# Altium project SATA-Modular-Backplane.PrjPcb
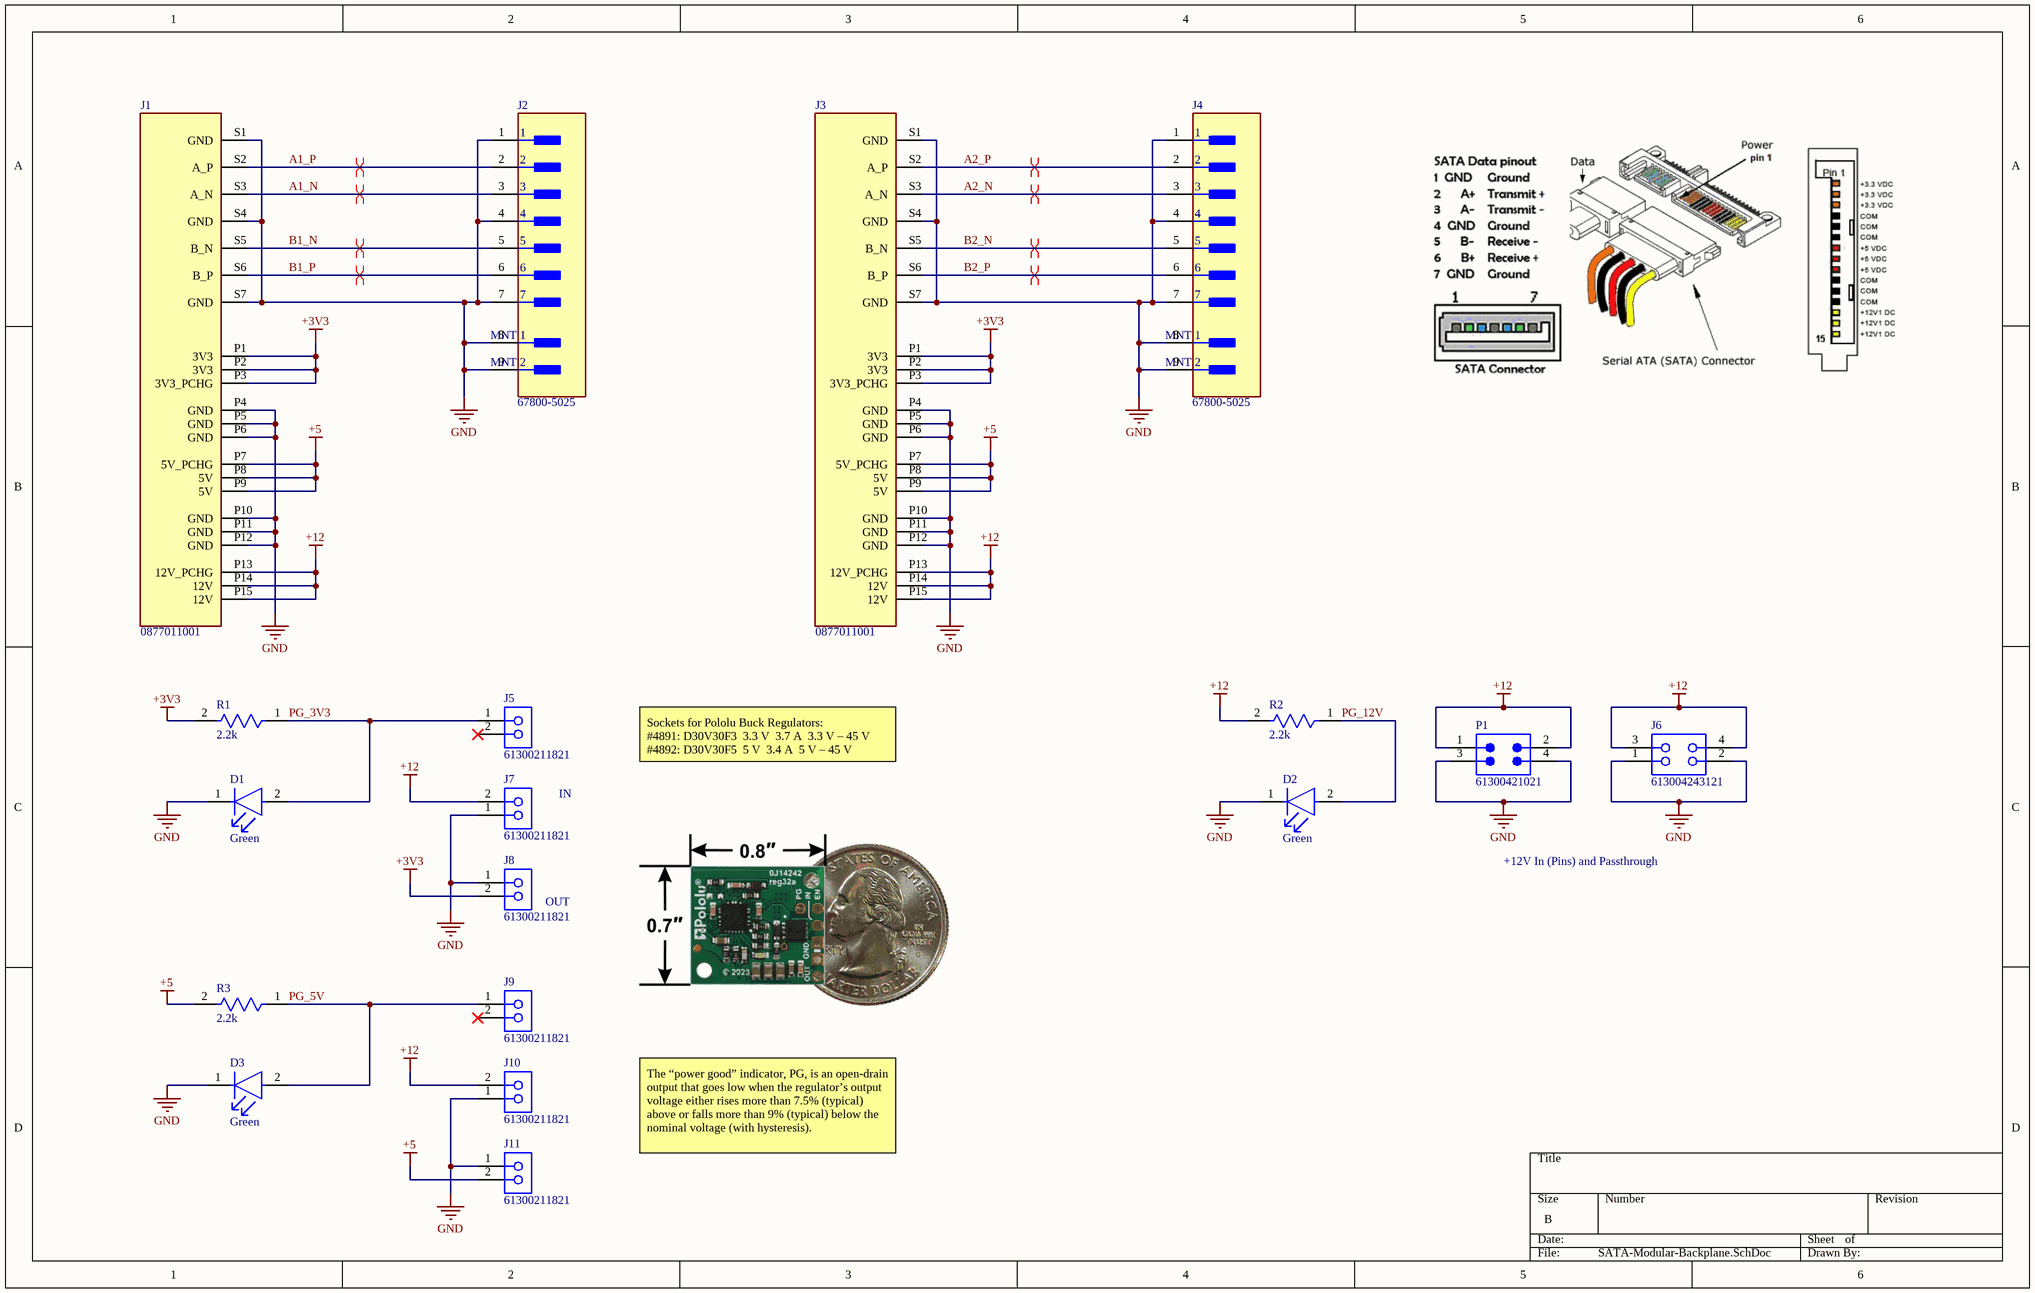
[diagram p0: SATA-Modular-Backplane.SchDoc]
1 sheet, 18 parts. Net scope: global (net labels, ports and power ports of the same name join across sheets).
Board file: SATA-Modular-Backplane.PcbDoc

## Sheet SATA-Modular-Backplane.SchDoc
size B; SheetNumber: 1; SheetTotal: 1

### Parts
D1  Green  [FP-LTST-C170GKT-MFG]
D2  Green  [FP-LTST-C170GKT-MFG]
D3  Green  [FP-LTST-C170GKT-MFG]
J1  0877011001  [0877011001]
J2  67800-5025  [FP-67800-5025-MFG]
J3  0877011001  [0877011001]
J4  67800-5025  [FP-67800-5025-MFG]
J5  61300211821  [61300211821]
J6  613004243121  [613004243121]
J7  61300211821  [61300211821]
J8  61300211821  [61300211821]
J9  61300211821  [61300211821]
J10  61300211821  [61300211821]
J11  61300211821  [61300211821]
P1  61300421021  [61300421021]
R1  2.2k  [FP-CRCW0805-e3-IPC_B]
R2  2.2k  [FP-CRCW0805-e3-IPC_B]
R3  2.2k  [FP-CRCW0805-e3-IPC_B]

### Nets
+3V3: J1.P1(3V3) J1.P2(3V3) J1.P3(3V3_PCHG) J3.P1(3V3) J3.P2(3V3) J3.P3(3V3_PCHG) J8.2 R1.2
+5: J1.P7(5V_PCHG) J1.P8(5V) J1.P9(5V) J3.P7(5V_PCHG) J3.P8(5V) J3.P9(5V) J11.2 R3.2
+12: J1.P13(12V_PCHG) J1.P14(12V) J1.P15(12V) J3.P13(12V_PCHG) J3.P14(12V) J3.P15(12V) J6.3 J6.4 J7.2 J10.2 P1.1 P1.2 R2.2
GND: D1.1(C) D2.1(C) D3.1(C) J1.P4(GND) J1.P5(GND) J1.P6(GND) J1.P10(GND) J1.P11(GND) J1.P12(GND) J1.S1(GND) J1.S4(GND) J1.S7(GND) J2.1 J2.4 J2.7 J2.8(MNT_1) J2.9(MNT_2) J3.P4(GND) J3.P5(GND) J3.P6(GND) J3.P10(GND) J3.P11(GND) J3.P12(GND) J3.S1(GND) J3.S4(GND) J3.S7(GND) J4.1 J4.4 J4.7 J4.8(MNT_1) J4.9(MNT_2) J6.1 J6.2 J7.1 J8.1 J10.1 J11.1 P1.3 P1.4
A1_N: J1.S3(A_N) J2.3
A1_P: J1.S2(A_P) J2.2
A2_N: J3.S3(A_N) J4.3
A2_P: J3.S2(A_P) J4.2
B1_N: J1.S5(B_N) J2.5
B1_P: J1.S6(B_P) J2.6
B2_N: J3.S5(B_N) J4.5
B2_P: J3.S6(B_P) J4.6
PG_3V3: D1.2(A) J5.1 R1.1
PG_5V: D3.2(A) J9.1 R3.1
PG_12V: D2.2(A) R2.1

Not connected (* = marked no-connect by the designer): J5 2*; J9 2*

### Layout directives
differential pair: A1_N, A1_P, A2_N, A2_P, B1_N, B1_P, B2_N, B2_P

### Notes on the sheet
- Sockets for Pololu Buck Regulators:
  #4891: D30V30F3  3.3 V  3.7 A  3.3 V – 45 V
  #4892: D30V30F5  5 V  3.4 A  5 V – 45 V
- IN
- (near J8) OUT
- +12V In (Pins) and Passthrough
- The “power good” indicator, PG, is an open-drain output that goes low when the regulator’s output voltage either rises more than 7.5% (typical) above or falls more than 9% (typical) below the nominal voltage (with hysteresis).

### Library data of the parts
D1-D3 = CMP-1674-00002-6: LED GREEN CLEAR SMD; Dominant Wavelength: 569nm; Lens Style: Diffused; Forward Voltage: 2.1V; Number of Elements: 1; Wavelength: 565nm; Luminous Intensity: 6mcd; Test Current: 10mA; Power Dissipation: 100mW; Reverse Voltage: 5V; Forward Current: 30mA; Viewing Angle: 130°; Lens Color: Colorless; Min Operating Temperature: -55°C; Number of Pins: 2; Max Operating Temperature: 85°C; Color: Green; Radiation Hardening: No; Illumination Color: Green; Case Code (Metric): 2012; Lens Transparency: Clear; Case/Package: 0805; Width: 1.25mm; Case Code (Imperial): 0805; Package Quantity: 1; Height: 1.1mm; Depth: 1.25mm; Length: 2mm; Power Rating: 100mW; Lead Free: Lead Free; Number of LEDs: 1; Packaging: Tape and Reel; Mount: Surface Mount; Voltage: 5V
J1 J3 = 0877011001: Connector; Manufacturer_Name: Molex; Description: I/O Connectors SATA COMBO HOST REC VT PFIT; Datasheet Link: https://www.molex.com/pdm_docs/sd/877011001_sd.pdf; Height: 8.25mm; Manufacturer_Part_Number: 0877011001; Mouser Part Number: N/A; Mouser Price/Stock: https://www.mouser.co.uk/ProductDetail/Molex/0877011001?qs=PBcRNPEHKsqwD0qCdO56GA%3D%3D; Arrow Part Number: 0877011001; Arrow Price/Stock: https://www.arrow.com/en/products/0877011001/molex
J2 J4 = CMP-04776-000822-1: CONN SATA HEADER 7POS SLD SMD; Number of Positions: 7; Pitch: 1.27mm; Voltage Rating (DC): 15V; Glow Wire Compliant: Non-compliant; Gender: Male; Current Rating: 1.5A; Packaging: Tray; Orientation: Straight; Termination: SMD/SMT; Contact Plating: Gold; Contact Material: Brass; Connector Type: SATA; Series: 67800; Mount: Surface Mount; Flammability Rating: UL94 V-0; Housing Material: Thermoplastic; Max Operating Temperature: 85°C; Color: Black; Radiation Hardening: No; Voltage Rating: 15V; Min Operating Temperature: -35°C; Package Quantity: 4800; Max Voltage Rating (AC): 15V; Number of Contacts: 7; Number of Rows: 1; Number of Circuits: 7
J5 J7-J11 = CMP-1502-01314-3: NexarPartId: 61924708; Operating Supply Voltage: 250V; Contact Resistance: 20mΩ; Current Rating: 3A; Gender: Female; RoHS: Non-Compliant; Lead Pitch: 2.54mm; Number of Pins: 2; Orientation: Vertical
J6 = CMP-1502-01409-3: NexarPartId: 61924715; Contact Resistance: 20mΩ; Operating Supply Voltage: 250V; Current Rating: 3A; Gender: Female; Lead Pitch: 2.54mm; Number of Pins: 4; RoHS: Non-Compliant
P1 = CMP-1502-01065-3: NexarPartId: 32855523; Row Spacing: 2.54mm; Number of Contacts: 4; Gender: Male; Operating Supply Voltage: 250V; Current Rating: 3A; Contact Resistance: 20mΩ; Connector Type: Male Pin; RoHS: Compliant; Contact Material: Copper; Packaging: Bulk; Termination: Solder; Lead Pitch: 2.54mm; Number of Positions: 4; Contact Plating: Gold; Color: Black; Contact Mating Length: 5.9944mm; Pitch: 2.54mm; Number of Pins: 4; Number of Rows: 2; Mount: Through Hole; REACH SVHC: Unknown
R1-R3 = CMP-2001-03760-2: RES Thick Film, 2.2kΩ, 1%, 0.125W, 100ppm/°C, 0805; Voltage Rating (DC): 150V; Max Power Dissipation: 125mW; Resistance: 2.2kR; Case/Package: 0805; Width: 1.25mm; Voltage Rating: 150V; Composition: Thick Film; Power Rating: 125mW; Packaging: Tape and Reel; Min Operating Temperature: -55°C; Contact Plating: Tin; Tolerance: 1%; Military Standard: Not; Case Code (Metric): 2012; Radiation Hardening: No; Termination: SMD/SMT; Lead Free: Lead Free; Case Code (Imperial): 0805; Max Operating Temperature: 155°C; Depth: 1.25mm; Weight: 0.000194oz; Number of Terminations: 2; Length: 2mm; Package Quantity: 10; Temperature Coefficient: 100ppm/°C; Features: Automotive AEC-Q200; Height: 0.45mm